# Altium schematic sheet Copy of MB1136.SchDoc: TOP & POWER
size A4; DocumentNumber: MB1136; Revision: C.3; SheetNumber: 1; SheetTotal: 3; Project: NUCLEO-XXXXRX
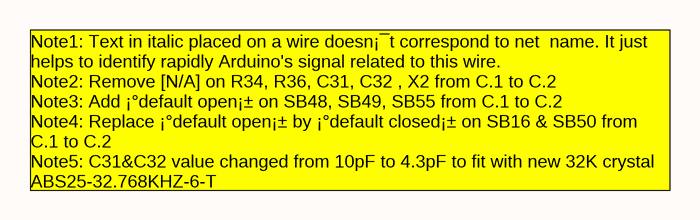
[diagram p0: Copy of MB1136.SchDoc]

## Notes on the sheet
- Note1: Text in italic placed on a wire doesn¡¯t correspond to net  name. It just helps to identify rapidly Arduino's signal related to this wire.
  Note2: Remove [N/A] on R34, R36, C31, C32 , X2 from C.1 to C.2
  Note3: Add ¡°default open¡± on SB48, SB49, SB55 from C.1 to C.2
  Note4: Replace ¡°default open¡± by ¡°default closed¡± on SB16 & SB50 from C.1 to C.2
  Note5: C31&C32 value changed from 10pF to 4.3pF to fit with new 32K crystal ABS25-32.768KHZ-6-T
  Note5: C26's value changed from 2.2uF to 4.7uF from C.2 to C.3
- Title:
- Project:
- Size:
- Date:
- A4
- Reference:
- Sheet:
- Revision:
- of